# Altium schematic sheet TRISECT_Leg.SchDoc
size A; SheetNumber: 2; SheetTotal: 2
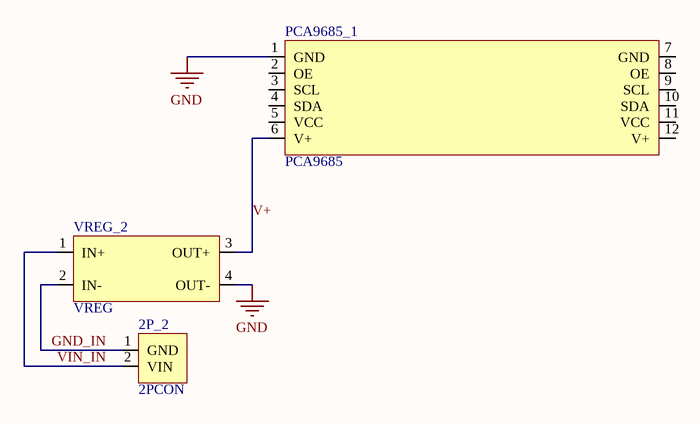
[diagram p0: TRISECT_Leg.SchDoc]

## Parts
2P_2  2PCON  [2PCON]
PCA9685_1  PCA9685  [PCA9685]
VREG_2  VREG  [VREG]

## Nets
GND: PCA9685_1.1(GND) VREG_2.4(OUT-)
GND_IN: 2P_2.1(GND) VREG_2.2(IN-)
V+: PCA9685_1.6(V+) VREG_2.3(OUT+)
VIN_IN: 2P_2.2(VIN) VREG_2.1(IN+)

Not connected (* = marked no-connect by the designer): PCA9685_1 2(OE) 3(SCL) 4(SDA) 5(VCC) 7(GND) 8(OE) 9(SCL) 10(SDA) 11(VCC) 12(V+)

## Library data of the parts
2P_2 = 2PCON: 2 pin connector
PCA9685_1 = PCA9685: PCA9685 PWM Servo Driver
VREG_2 = VREG: Voltage Regulator - basic pinout